# EAGLE design umlma (EAGLE 7.1.0)
DATABASE: ./../PARTSDB.TXT
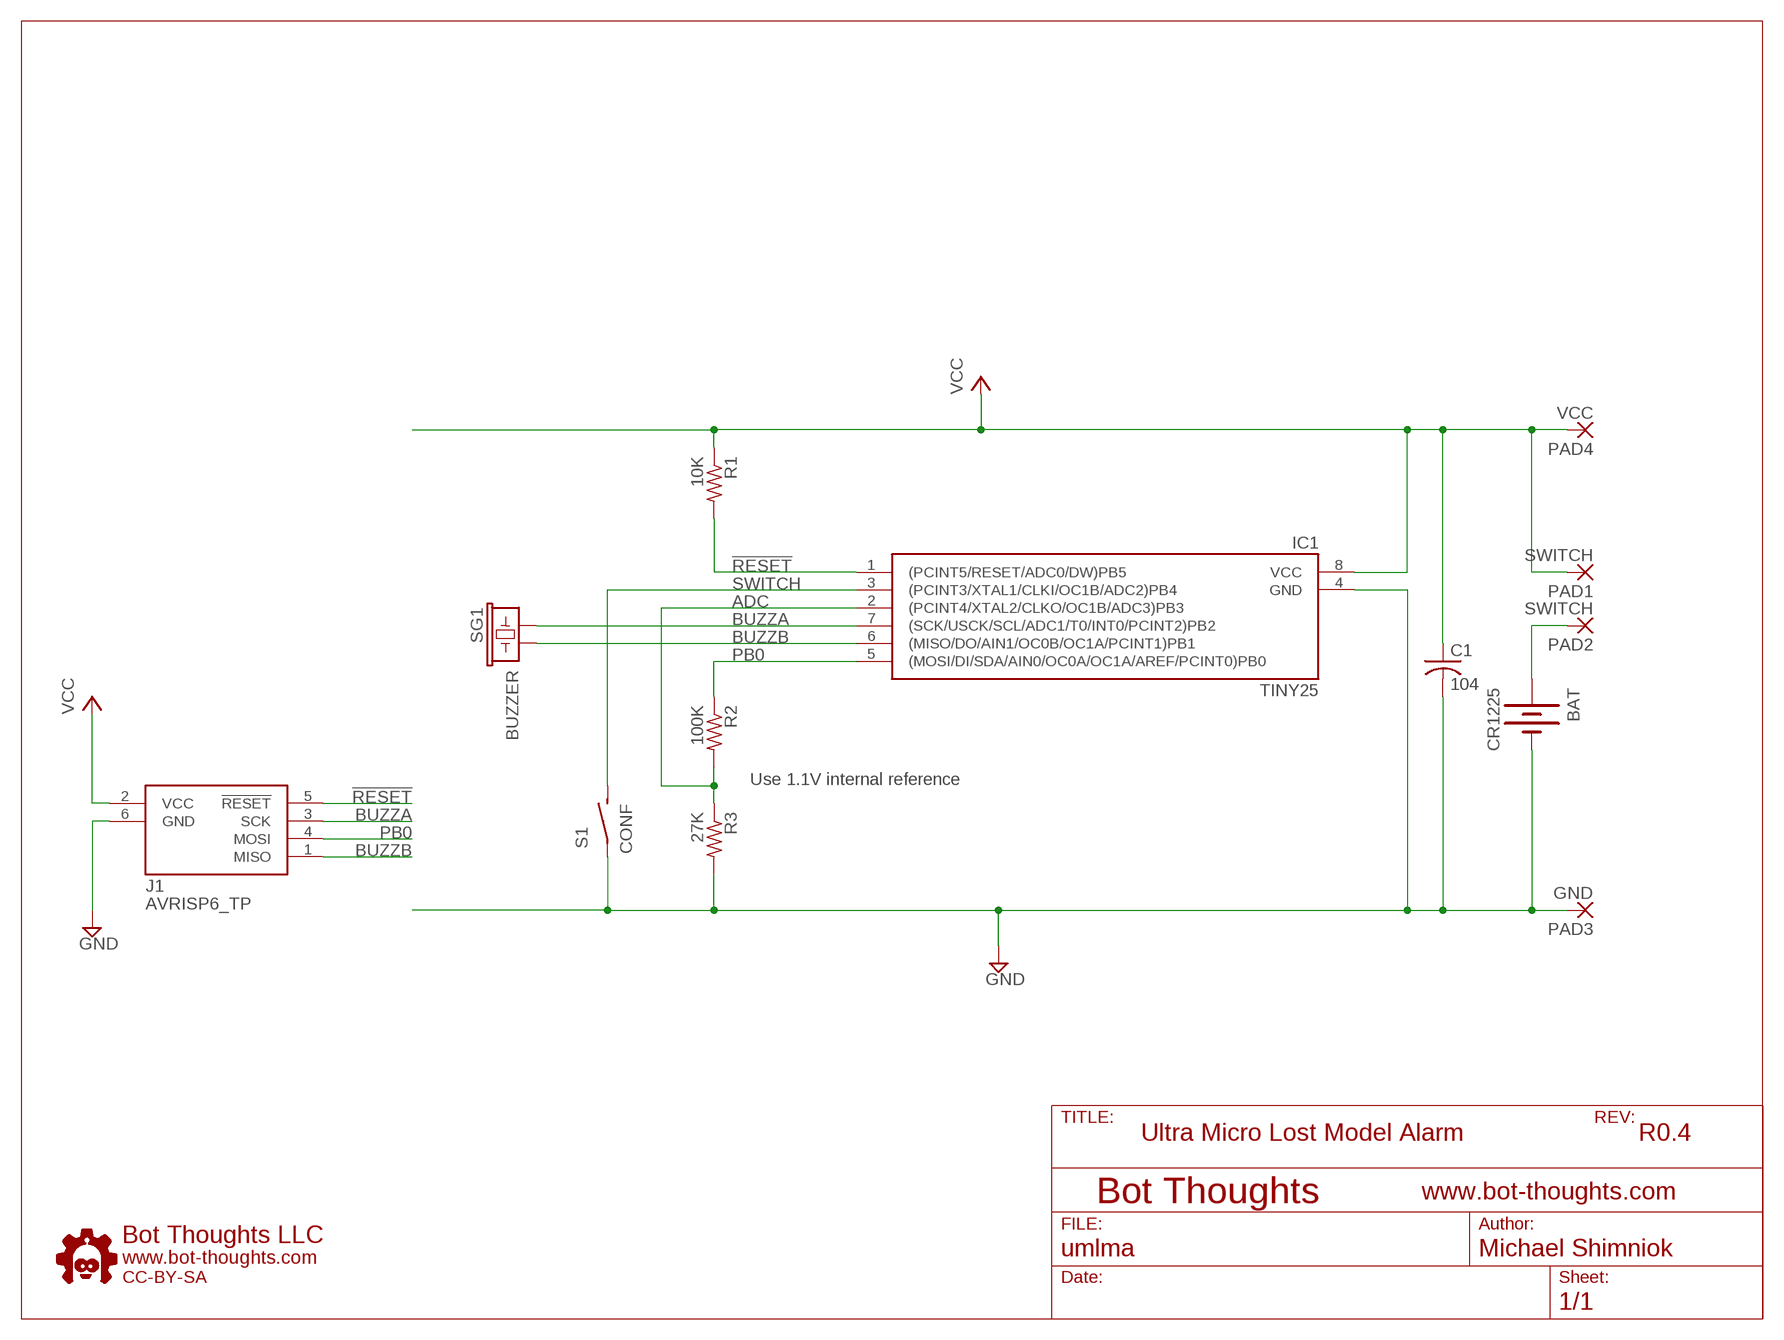
[diagram p0: schematic, sheet 1]

## Parts
BAT  CR1225  BATTERY12PTH  [BATTCON_12MM_PTH]
C1  104  C-USC0603K  [C0603K]
IC1  TINY25  TINY25-20SSU  [SOIC8N]
J1  AVRISP6_TP  [2X3_TP]
PAD1  SWITCH  WIREPAD1,6/0,8  [1,6/0,8]
PAD2  SWITCH  WIREPAD1,6/0,8  [1,6/0,8]
PAD3  GND  WIREPAD1,6/0,8  [1,6/0,8]
PAD4  VCC  WIREPAD1,6/0,8  [1,6/0,8]
R1  10K  R-US_R0603  [R0603]
R2  100K  R-US_R0603  [R0603]
R3  27K  R-US_R0603  [R0603]
S1  CONF  SPST_3X4X2  [3X4X2TACT]
SG1  BUZZER  BUZZER-AT-1438-TWT-R-VERT  [BUZZER_14MM_V_PTH]
U$1  BTLOGO-LOGO-SM  [BTLOGOS]

## Nets
!RESET: IC1.1((PCINT5/RESET/ADC0/DW)PB5) J1.5(!RESET) R1.2
ADC: IC1.2((PCINT4/XTAL2/CLKO/OC1B/ADC3)PB3) R2.2 R3.1
BUZZA: IC1.7((SCK/USCK/SCL/ADC1/T0/INT0/PCINT2)PB2) J1.3(SCK) SG1.P$5
BUZZB: IC1.6((MISO/DO/AIN1/OC0B/OC1A/PCINT1)PB1) J1.1(MISO) SG1.P$6
GND: BAT.GND(-) C1.2 IC1.4(GND) J1.6(GND) PAD3.1(P) R3.2 S1.P$1(P)
N$2: BAT.VCC@1(+) PAD2.1(P)
PB0: IC1.5((MOSI/DI/SDA/AIN0/OC0A/OC1A/AREF/PCINT0)PB0) J1.4(MOSI) R2.1
SWITCH: IC1.3((PCINT3/XTAL1/CLKI/OC1B/ADC2)PB4) S1.P$2(S)
VCC: C1.1 IC1.8(VCC) J1.2(VCC) PAD1.1(P) PAD4.1(P) R1.1

## Notes on the sheet
- Use 1.1V internal reference
- Ultra Micro Lost Model Alarm | R0.4

## Library data of the parts
BAT = SparkFun:BATTERY: Battery Holders Various common sizes : AA, AAA, 20mm coin cell and 12mm coin cell.; BOM: EXCLUDE
C1 = rcl:C-US: CAPACITOR, American symbol; PARTNO: GRM188R60J105KA01D
IC1 = bt_avr:TINY25: Atmel AVR ATiny25,45,85 8-bit Microcontroller.
J1 = bt_avr:AVRISP6: 6-pin dual-row connector for Atmel AVRISP programmer interface
PAD1-PAD4 = wirepad:WIREPAD: Wire PAD connect wire on PCB; BOM: EXCLUDE
R1-R3 = rcl:R-US_: RESISTOR, American symbol; PARTNO: ERJ-3GEYJ102V
S1 = bt_electromech:SPST: SPST SWITCH
SG1 = bt_buzzer:BUZZER: Buzzer 12mm Spark Fun Electronics SKU : Comp-Buzzer; PARTNO: AT-1438-TWT-R
U$1 = bt:BTLOGO: Bot Thoughts Logo

## Board
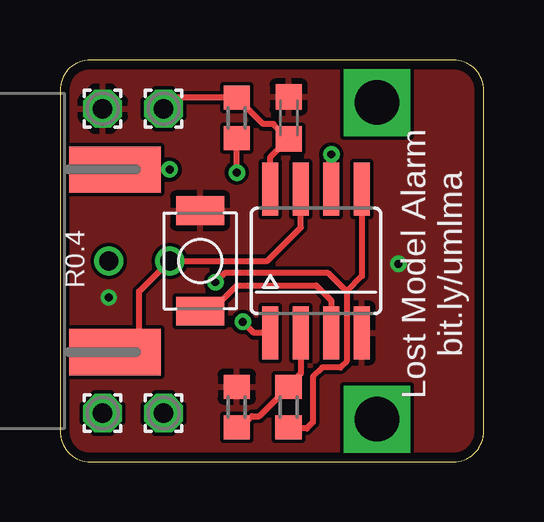
[diagram p1: board, top side]
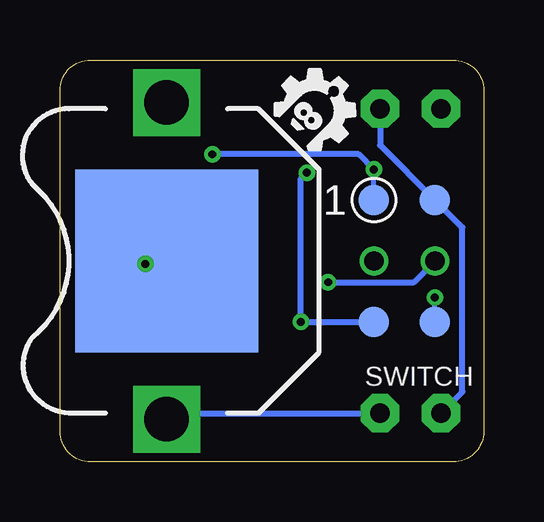
[diagram p2: board, bottom side, seen from below]

Size 17.65 x 16.76 mm. Coordinates in mm from the lower left corner, seen from the top.
Outline: 16.38,16.76 1.27,16.76 arc90 0,15.49 0,1.27 arc90 1.27,0 16.38,0 arc90 17.65,1.27 17.65,15.49 arc90 16.38,16.76
Copper layers (1*16): Top 0.0356mm / dielectric 1.5011mm / Bottom 0.0356mm
Design rules "LaenPCBOrder": minimum track width 6mil, minimum drill 13mil, track to track 6mil, track to pad 6mil, pad to pad 6mil, via to via 6mil, smd to smd 6mil, copper to edge 15mil, drill to drill 6mil, minimum pad ring 7mil, minimum via ring 7mil, stop-mask expansion 3mil, vias tented up to drill 20mil, thermal gap 10mil

### Footprints (pad centres in the part's own frame; a part is rotated, then mirrored left to right if it is on the bottom)
BATTCON_12MM_PTH = smd 7.62 x 7.62: GND 0,0 | drill 1.854 square: VCC@1 -6.604,0; VCC@2 6.604,0
C0603K = smd 1.05 x 1.08: 1 -0.875,0; 2 0.875,0
SOIC8N = smd 0.66 x 2.2: 1 -1.905,-3; 2 -0.635,-3; 3 0.635,-3; 4 1.905,-3; 5 1.905,3; 6 0.635,3; 7 -0.635,3; 8 -1.905,3
2X3_TP = smd 1.27 x 1.27: 1 -1.27,2.54; 2 1.27,2.54; 5 -1.27,-2.54; 6 1.27,-2.54 | drill 0.8: 3 -1.27,0; 4 1.27,0
1,6/0,8 = drill 0.813 pad 1.6 octagon: 1 0,0
R0603 = smd 1 x 1.1: 1 -0.85,0; 2 0.85,0
3X4X2TACT = smd 1.2 x 2: P$1 -2.1,0; P$2 2.1,0
BUZZER_14MM_V_PTH = smd 3.81 x 1.93: P$5 0.381,3.81; P$6 0.381,-3.81

### Placement (x,y rotation side)
BAT  13.21,8.38 90 bottom
C1  9.53,14.35 90 top
IC1  10.67,8.38 0 top
J1  3.3,8.38 0 bottom
PAD1  1.78,2.03 270 top
PAD2  4.32,2.03 270 top
PAD3  1.78,14.73 0 top
PAD4  4.32,14.73 0 top
R1  7.37,14.35 270 top
R2  9.53,2.29 90 top
R3  7.37,2.29 90 top
S1  5.84,8.38 270 top
SG1  2.67,8.38 180 top
U$1  8.13,13.66 315 bottom

### Tracks (layer width: path | path; a pad name or v marks a point on that pad's centre or on a via)
!RESET  (via drill 0.33)
  Top 0.254: IC1.1 8.08,5.38 v7.62,5.84 | v7.37,12.06 R1.2
  Bottom 0.254: J1.5 v7.62,5.84 7.62,11.81 v7.37,12.06
ADC
  Top 0.254: IC1.2 10.03,3.68 9.53,3.17 R2.2 8.29,1.91 8,1.91 7.53,1.44 R3.1
BUZZA
  Top 0.254: IC1.7 10.03,9.78 8.64,8.38 J1.3 3.3,7.11 3.3,4.7 3.17,4.57 SG1.P$5
BUZZB  (via drill 0.33)
  Top 0.254: SG1.P$6 v4.57,12.19
  Top 0.406: IC1.6 v11.3,12.83
  Bottom 0.203: J1.1 v4.57,12.19
  Bottom 0.254: v4.57,12.19 5.21,12.83 v11.3,12.83
GND  (via drill 0.33)
  Bottom 0.203: J1.6 v2.03,6.86 | BAT.GND v14.1,8.26
  pour Top: 0,1.27 0,15.49 arc-90 1.27,16.76 16.38,16.76 arc-90 17.65,15.49 17.65,1.27 arc-90 16.38,0 1.27,0 arc-90
N$2
  Bottom 0.254: BAT.VCC@1 12.45,2.03 PAD2.1
PB0  (via drill 0.33)
  Top 0.254: IC1.5 12.57,7.75 11.94,7.11 | 11.94,7.11 11.94,4.19 11.68,3.94 10.92,3.94 10.54,3.56 10.54,1.65 10.29,1.4 9.56,1.4 R2.1 | 11.94,7.11 11.18,7.87 6.86,7.87 v6.48,7.49
  Bottom 0.254: v6.48,7.49 2.92,7.49 J1.4
SWITCH
  Top 0.254: S1.P$2 6.28,6.28 7.37,7.37 10.67,7.37 11.3,6.73 IC1.3
VCC
  Top 0.254: PAD4.1 4.79,15.2 R1.1 8.47,14.1 8.89,14.1 9.51,13.48 C1.1 8.76,12.71 IC1.8
  Bottom 0.254: PAD4.1 4.32,13.21 J1.2 0.89,9.78 0.89,2.92 PAD1.1

### Text on the board
tNames: Lost Model Alarm | bit.ly/umlma | R0.4
bNames: SWITCH
tsilk: 10K | 104 | TINY25 | R0.4 | Ultra Micro | Lost Model Alarm | 33K | 220K | http://bit.ly/umlma
bsilk: CR1225 | GND | VCC | 1 | SWITCH